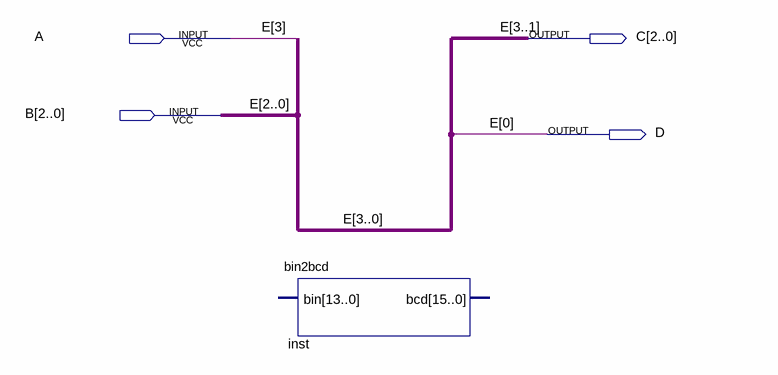
[diagram p0: schematic sheet]
// Quartus schematic test.bdf as structural Verilog: 1 symbols, 4 pins
module test (
  input  A,
  input  [2:0] B,
  output [2:0] C,
  output D
);

  bin2bcd inst ();  // open: bin, bcd

  assign C = {A, B[2:1]};
  assign D = B[0];

  // Other names for the same wires on the sheet: E[3:0] = {A, B}
endmodule
